# Altium schematic sheet Sheet2.SchDoc
size A4; SheetNumber: 1; SheetTotal: 1
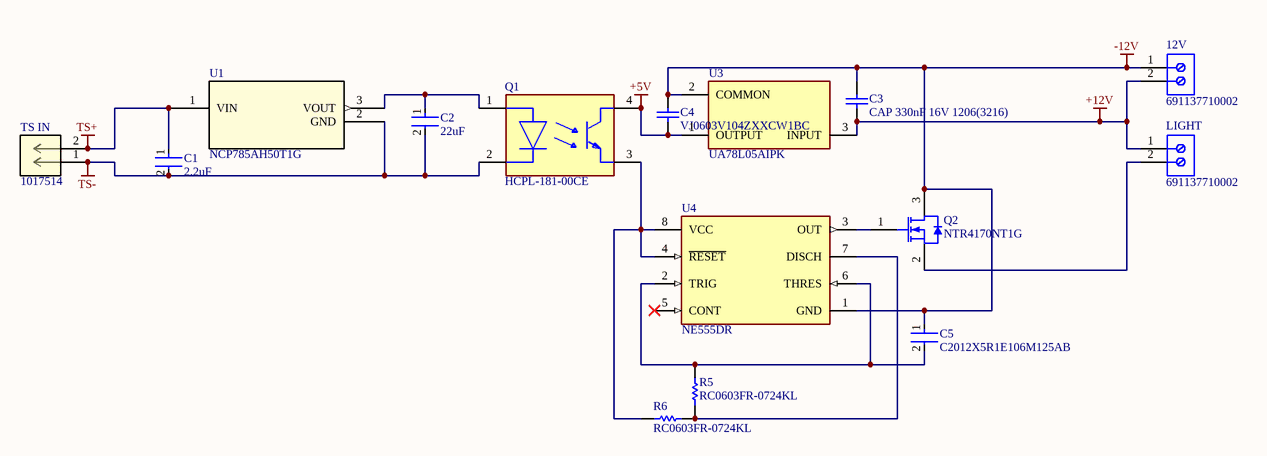
[diagram p0: Sheet2.SchDoc]

## Parts
12V  691137710002  [691137710002]
C1  2.2uF  [FP-C5750-250-0_4-IPC_C]
C2  22uF  [FP-GRM21B-0_15-MFG]
C3  CAP 330nF 16V 1206(3216)  [CAPC1206(3216)110_M]
C4  VJ0603V104ZXXCW1BC  [CAPC1608X95X40ML15T15]
C5  C2012X5R1E106M125AB  [FP-C2012-125-0_2-MFG]
LIGHT  691137710002  [691137710002]
Q1  HCPL-181-00CE  [FP-SO-4-MFG]
Q2  NTR4170NT1G  [ONSC-SOT-23-3-318-08_V]
R5  RC0603FR-0724KL  [RESC1608X55X25NL10T15]
R6  RC0603FR-0724KL  [RESC1608X55X25NL10T15]
TS_IN  1017514  [CONN_1017514]
U1  NCP785AH50T1G  [SOT-89-3_2P7X4P7_ONS]
U3  UA78L05AIPK  [FP-PK0003A-MFG]
U4  NE555DR  [FP-D0008A-IPC_A]

## Nets
+5V: C4.1 Q1.4(C) U3.1(OUTPUT)
+12V: 12V.2 C3.1 LIGHT.1 U3.3(INPUT)
-12V: 12V.1 C3.2 C4.2 C5.1 Q2.3(D) U3.2(COMMON) U4.1(GND)
TS+: C1.1 TS_IN.2 U1.1(VIN)
TS-: C1.2 C2.2 Q1.2(C) TS_IN.1 U1.2(GND)
NetC2_1: C2.1 Q1.1(A) U1.3(VOUT)
NetC5_2: C5.2 R5.2 U4.2(TRIG) U4.6(THRES)
NetLIGHT_2: LIGHT.2 Q2.2(S)
NetQ1_3: Q1.3(E) R6.1 U4.4(~{RESET}) U4.8(VCC)
NetQ2_1: Q2.1(G) U4.3(OUT)
NetR5_1: R5.1 R6.2 U4.7(DISCH)

Not connected (* = marked no-connect by the designer): U4 5(CONT)*

## Library data of the parts
12V LIGHT = CMP-1502-03324-2: NexarPartId: 78871135; Voltage Rating: 300V; Number of Contacts: 2; Current Rating: 16A; Lead Pitch: 5mm; Height: 11.6mm; Packaging: Box; RoHS: Non-Compliant; Contact Material: Nickel, Tin; Max Operating Temperature: 120°C; Number of Pins: 2; Min Operating Temperature: -30°C; Number of Rows: 1
C1 = CMP-08246-007091-1: Multilayer Ceramic Capacitors 2.2uF ±20% 450V X6S SMD 2220; Tolerance: 20%; Min Operating Temperature: -55°C; Voltage Rating: 450V; Capacitance: 2.2uF; Case Code (Imperial): 2220; Series: C; Thickness: 0.11inch; Max Operating Temperature: 105°C; Package Quantity: 500; Length: 0.224inch; RoHS Compliant: Yes; Packaging: Tape and Reel; Case Code (Metric): 5750; Width: 0.197inch; Case/Package: 2220; Mount: Surface Mount
C2 = CMP-2007-03385-2: Chip Multilayer Ceramic Capacitors for General Purpose, 0805, 22uF, X5R, 15%, 20%, 6.3V; Material: Ceramic; Max Operating Temperature: 85°C; Voltage: 6.3V; Min Operating Temperature: -55°C; Case/Package: 0805; Thickness: 0.053inch; Dielectric: X5R; Packaging: Tape and Reel; Depth: 1.25mm; Termination: SMD/SMT; Voltage Rating (DC): 6.3V; Radiation Hardening: No; Tolerance: 20%; Mount: Surface Mount; Lead Free: Lead Free; Package Quantity: 1; REACH SVHC: No SVHC; Voltage Rating: 6.3V; Capacitance: 22uF; Length: 2mm; Case Code (Imperial): 0805; Case Code (Metric): 2012; Width: 0.049inch; Height: 1.25mm
C3 = CMP-1037-04464-1: CAP 330nF 16V ±10% 1206 (3216 Metric) Thickness 1.05mm SMD; Tolerance: Â±10%; Case-Metric: 3216; Case-EIA: 1206; Value: 330nF; Max Thickness: 1.05 mm; Rated Voltage: 16 V; Technology: SMT
C4 = CMP-1035-02590-2: Manufacturer: Vitramon; Part Number: VJ0603V104ZXXCW1BC
C5 = CMP-08246-005781-1: Multilayer Ceramic Capacitors 10μF ±20% 25V X5R SMD 0805; Capacitance: 10uF; Series: C; Case Code (Metric): 2012; RoHS Compliant: Yes; Packaging: Tape and Reel; Dielectric Material: Ceramic; Length: 2mm; Package Quantity: 1; Width: 1.2mm; Dielectric: X5R; Tolerance: 20%; Mount: Surface Mount; Weight: 0.000194oz; Voltage Rating: 25V; Case/Package: 0805; Height: 1.25mm; Lead Free: Lead Free; Thickness: 0.057inch; Voltage Rating (DC): 25V; Resistor Type: Ceramic; Min Operating Temperature: -55°C; Case Code (Imperial): 0805; Depth: 1.25mm; Termination: SMD/SMT; Max Operating Temperature: 85°C
Q1 = CMP-18400-000021-1: OPTOISO 3.75KV TRANS 4MINIFLAT; Manufacturer: Broadcom; Min Current Transfer Ratio: 200%; Isolation Voltage: 3750Vrms; Turn Off Delay Time: 4us; Turn On Delay Time: 3us; Reverse Voltage: 6V; Standoff Height: 0mm; Forward Voltage: 1.2V; Power Dissipation: 170mW; Collector Emitter Voltage: 80V; Max Current Transfer Ratio: 400%; Forward Current: 20mA; Octopart: https://octopart.com/hcpl-181-00ce-broadcom-71128032; ComponentLink2Description: Datasheet; Height: 2.4mm; Temperature Range Low: -55°C; Ambient Temperature Range Low: -55°C; Lead Free: Yes; Mouser Description: Transistor Output Optocouplers 3750 Vrms 0.2mA; Automotive: No; Emiiter Collector Voltage: 6V; Category: Trans; Ipc Land Pattern Name: SOIC254P700X210-4; Digikey Description: OPTOISO 3.75KV TRANS 4MINIFLAT; Temperature: -55°C to +100°C; Device Class L3: unset; ComponentLink2URL: https://docs.broadcom.com/docs/AV02-0774EN; RoHS: TRUE; Package: SO-4; Manufacturer Part Number: HCPL-181-00CE; Device Class L1: Optoelectronics; Temperature Range High: +100°C; Device Class L2: Optocouplers; Ambient Temperature Range High: +100°C
Q2 = CMP-1058-00736-1: Power MOSFET, 30 V, 3.1 A, Single N-Channe, 3-Pin SOT-23, Pb-Free, Tape and Reel; Manufacturer: On Semiconductor; VGS Max (V): 12; Qrr Typ (nC): 2.9; Ciss Typ (pF): 432; Coss Typ (pF): 53.6; V(BR)DSS Min (V): 30; VGS(th) Max (V): 1.4; Channel Polarity: N Channel; Crss Typ (pF): 37.1; ComponentLink3URL: http://www.onsemi.cn/pub_link/Collateral/318-08.PDF; ComponentLink3Description: Package Specification; RoHS: Pb-Free; PackageVersion: Rev. AP, 11/2009; DatasheetVersion: Rev. 1; PackageDescription: 3-Pin Small Outline Transistor, Body 2.92 x 1.3 mm, Pitch 0.95 mm; ComponentLink2Description: Datasheet; ComponentLink2URL: http://www.onsemi.cn/pub_link/Collateral/NTR4170N-D.PDF; Package Type: SOT-23-3; PartNumber: NTR4170NT1G; ComponentLink1Description: Manufacturer URL; Mounting Technology: Surface Mount; Packing: Tape and Reel; Configuration: Single; PackageReference: SOT-23-3-318-08; ComponentLink1URL: http://www.onsemi.com/
R5 R6 = CMP-2000-03968-1: Manufacturer: Yageo; Part Number: RC0603FR-0724KL
TS_IN = CMP-002-00077-5: Barrier Strip Terminal Block; RoHS Compliant: Yes
U1 = NCP785AH50T1G: No Description Available; Mfr_Name: onsemi; RefDes: RefDes; Type: Type
U3 = CMP-04917-000006-1: IC REG LINEAR 5V 100MA SOT89-3; Manufacturer: Texas Instruments; Max Junction Temp: +125°C; Min Supply Voltage: 7V; Output Type: Fixed; Dropout Voltage: 1.7V; Number Of Outputs: 1; Max Supply Voltage: 20V; Height: 1.6mm; ComponentLink2Description: Datasheet; Lead Free: Yes; Temperature Range High: +125°C; Package: PK0003A; Output Current: 100mA; ComponentLink2URL: http://www.ti.com/lit/ds/symlink/ua78l.pdf; Category: IC; Device Class L2: Power Management ICs; Digikey Description: IC REG LINEAR 5V 100MA SOT89-3; Temperature: -40°C to +125°C; RoHS: TRUE; Device Class L1: Integrated Circuits (ICs); Manufacturer Part Number: UA78L05AIPK; Mouser Description: Linear Voltage Regulators 5V 100mA Fixed Pos Voltage Regulator; Temperature Range Low: -40°C; Octopart: https://octopart.com/ua78l05aipk-texas+instruments-525592; Output Voltage: 5V; Device Class L3: Voltage Regulators - Linear; Automotive: No
U4 = CMP-1685-00007-2: IC OSC SGL TIMER 100KHZ 8-SOIC; Low Level Output Current: 200mA; Quiescent Current: 15mA; Min Supply Voltage: 4.5V; Number of Timers/Counters: 1; Max Supply Voltage: 16V; Operating Supply Current: 10mA; High Level Output Current: -200mA; Packaging: Tape and Reel; Frequency: 100kHz; Weight: 0.002561oz; REACH SVHC: No SVHC; Package Quantity: 2500; Width: 3.91mm; Max Operating Temperature: 70°C; Contact Plating: Gold; Lead Free: Lead Free; Number of Pins: 8; Min Operating Temperature: 0°C; Radiation Hardening: No; Length: 4.9mm; Case/Package: SOIC; Height: 1.58mm; Mount: Surface Mount